# Altium schematic sheet Micro.SchDoc
size A4; SheetNumber: 5; SheetTotal: 6
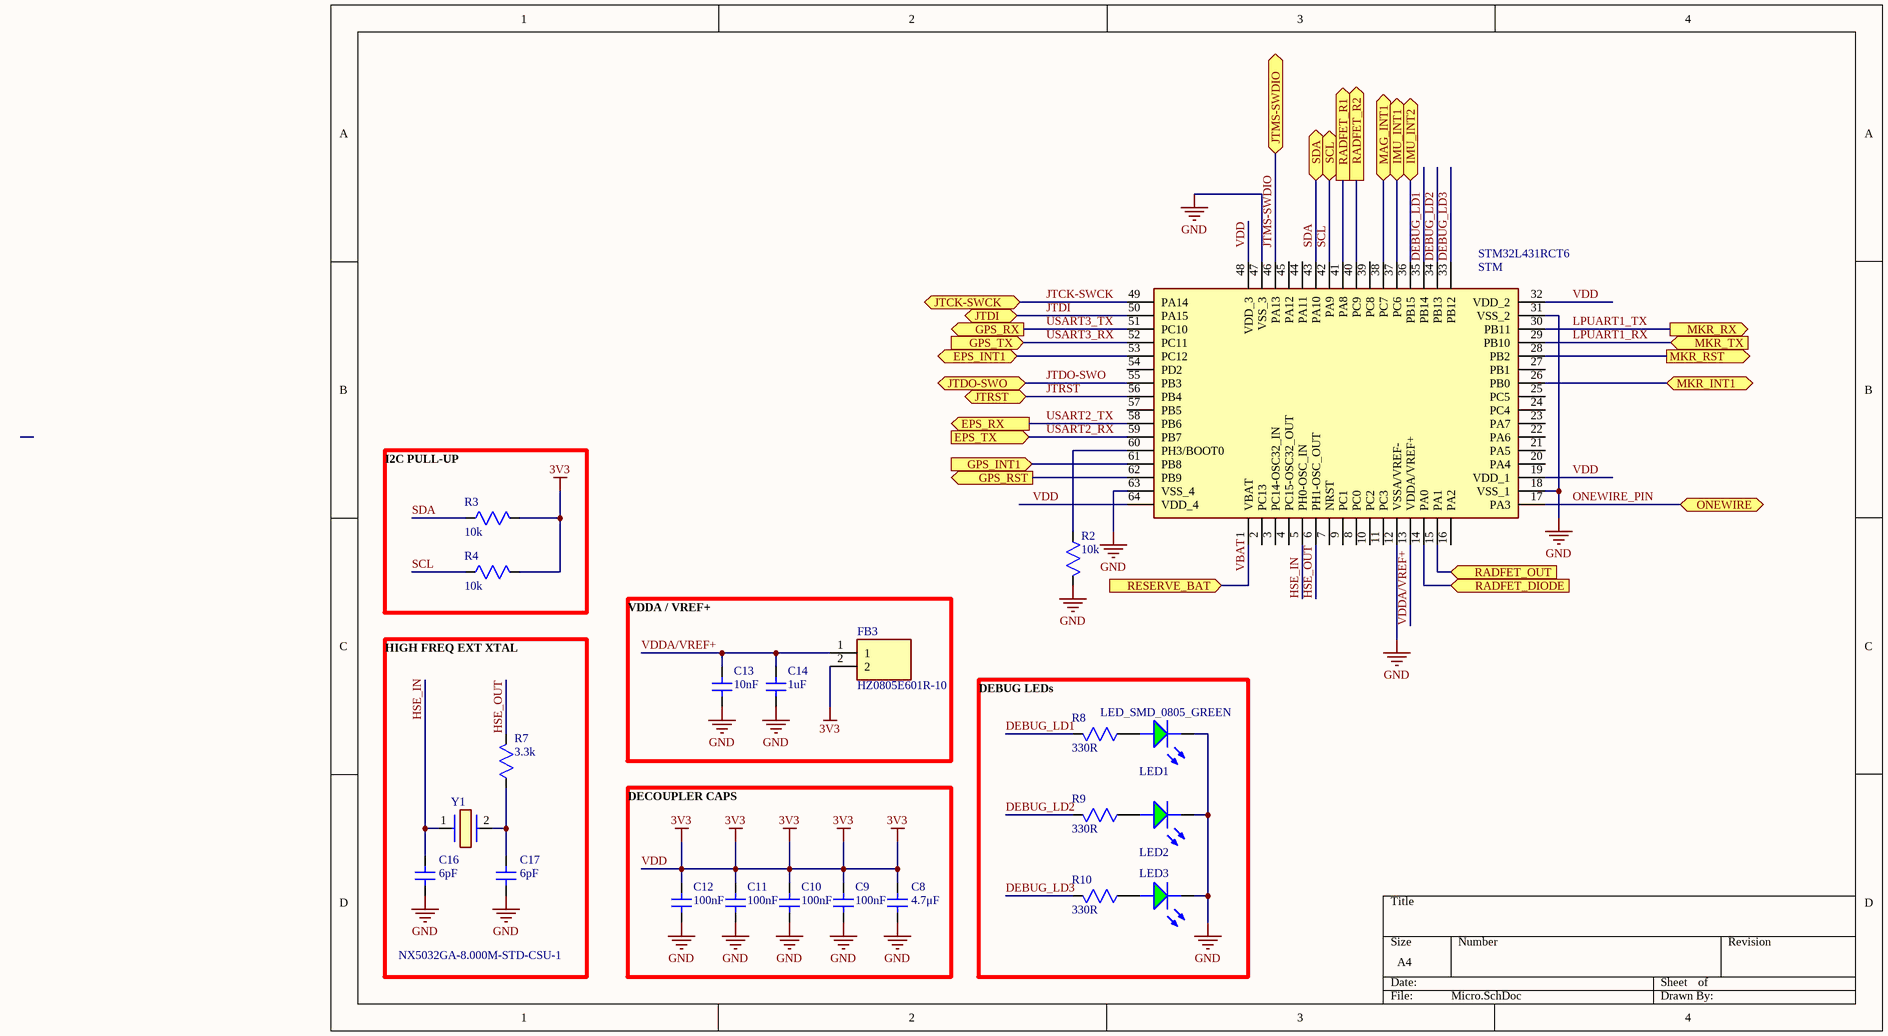
[diagram p0: Micro.SchDoc]

## Parts
C8  Valor: 4.7μF  [CAP SMD 0805]  (hidden comment: CAP_0805_4.7uF)
C9  Valor: 100nF  [CAP SMD 0805]  (hidden comment: CAP_0805_100nF)
C10  Valor: 100nF  [CAP SMD 0805]  (hidden comment: CAP_0805_100nF)
C11  Valor: 100nF  [CAP SMD 0805]  (hidden comment: CAP_0805_100nF)
C12  Valor: 100nF  [CAP SMD 0805]  (hidden comment: CAP_0805_100nF)
C13  Valor: 10nF  [CAP SMD 0805]  (hidden comment: CAP_0805_100nF)
C14  Valor: 1uF  [CAP SMD 0805]  (hidden comment: CAP_0805_100nF)
C16  Valor: 6pF  [CAP SMD 0805]  (hidden comment: CAP_0805_4.7uF)
C17  Valor: 6pF  [CAP SMD 0805]  (hidden comment: CAP_0805_4.7uF)
FB3  HZ0805E601R-10  [BEADC2012X110N]
LED1  LED_SMD_0805_GREEN  [LED SMD 0805 GREEN]  (value not drawn)
LED2  LED_SMD_0805_GREEN  [LED SMD 0805 GREEN]  (value not drawn)
LED3  LED_SMD_0805_GREEN  [LED SMD 0805 GREEN]
R2  Valor: 10k  [RES SMD 0805]  (hidden comment: RES_0805_10k)
R3  Valor: 10k  [RES SMD 0805]  (hidden comment: RES_0805_10k)
R4  Valor: 10k  [RES SMD 0805]  (hidden comment: RES_0805_10k)
R7  Valor: 3.3k  [RES SMD 0805]  (hidden comment: RES_0805_10k)
R8  Valor: 330R  [RES SMD 0805]  (hidden comment: RES_0805_10k)
R9  Valor: 330R  [RES SMD 0805]  (hidden comment: RES_0805_10k)
R10  Valor: 330R  [RES SMD 0805]  (hidden comment: RES_0805_10k)
STM  STM32L431RCT6  [QFP50P1200X1200X160-64N]
Y1  NX5032GA-8.000M-STD-CSU-1  [NX5032GA8000MSTDCSU1]

## Ports
EPS_INT1 (bidir, see General[2A], Conectores[3A]), EPS_RX (out, see General[2B], Conectores[2B]), EPS_TX (in, see General[2A], Conectores[2B]), GPS_INT1 (in, see General[2D], GPS_NEOM8M[3B]), GPS_RST (out, see General[2D], GPS_NEOM8M[3B]), GPS_RX (out, see General[2D], GPS_NEOM8M[1B]), GPS_TX (in, see General[2D], GPS_NEOM8M[1B]), IMU_INT1 (bidir, see General[2C], IMU[2B]), IMU_INT2 (bidir, see General[2C], IMU[3B]), JTCK-SWCK (bidir, see General[2B], Conectores[1B]), JTDI (bidir, see General[2B], Conectores[1B]), JTDO-SWO (bidir, see General[2B], Conectores[1B]), JTMS-SWDIO (bidir, see General[2B], Conectores[1B]), JTRST (bidir, see General[2B], Conectores[1C]), MAG_INT1 (bidir, see General[2C], Magneto[3B]), MKR_INT1 (bidir, see General[2B], Conectores[3D]), MKR_RST (out, see General[2B], Conectores[2D]), MKR_RX (out, see General[2B], Conectores[2D]), MKR_TX (in, see General[2B], Conectores[2D]), ONEWIRE (bidir, see General[2A], Conectores[1C]), RADFET_DIODE (in, see General[3B], Conectores[3A]), RADFET_OUT (in, see General[3B], Conectores[2A]), RADFET_R1 (out, see General[3A], Conectores[2A]), RADFET_R2 (out, see General[3A], Conectores[2A]), RESERVE_BAT (in, see General[2D], Conectores[2B], GPS_NEOM8M[1B]), SCL (bidir, see General[2C], Conectores[2A], Conectores[4B], IMU[2B], Magneto[2B]), SDA (bidir, see General[2C], Conectores[2A], Conectores[4B], IMU[2B], Magneto[2B])

## Nets
GND: C8.2 C9.2 C10.2 C11.2 C12.2 C13.2 C14.2 C16.2 C17.2 LED1.2(K) LED2.2(K) LED3.2(K) R2.2 STM.12(VSSA/VREF-) STM.18(VSS_1) STM.31(VSS_2) STM.47(VSS_3) STM.63(VSS_4)
VDD: C8.1 C9.1 C10.1 C11.1 C12.1 FB3.2 R3.2 R4.2 STM.19(VDD_1) STM.32(VDD_2) STM.48(VDD_3) STM.64(VDD_4)  [also labelled 3V3]
DEBUG_LD1: R8.2 STM.35(PB14)
DEBUG_LD2: R9.2 STM.34(PB13)
DEBUG_LD3: R10.2 STM.33(PB12)
EPS_INT1: STM.53(PC12) ; port EPS_INT1
GPS_INT1: STM.61(PB8) ; port GPS_INT1
GPS_RST: STM.62(PB9) ; port GPS_RST
HSE_IN: C16.1 STM.5(PH0-OSC_IN) Y1.1
HSE_OUT: R7.2 STM.6(PH1-OSC_OUT)
IMU_INT1: STM.37(PC6) ; port IMU_INT1
IMU_INT2: STM.36(PB15) ; port IMU_INT2
JTCK-SWCK: STM.49(PA14) ; port JTCK-SWCK
JTDI: STM.50(PA15) ; port JTDI
JTDO-SWO: STM.55(PB3) ; port JTDO-SWO
JTMS-SWDIO: STM.46(PA13) ; port JTMS-SWDIO
JTRST: STM.56(PB4) ; port JTRST
LPUART1_RX: STM.29(PB10) ; port MKR_TX
LPUART1_TX: STM.30(PB11) ; port MKR_RX
MAG_INT1: STM.38(PC7) ; port MAG_INT1
MKR_INT1: STM.26(PB0) ; port MKR_INT1
MKR_RST: STM.28(PB2) ; port MKR_RST
ONEWIRE_PIN: STM.17(PA3) ; port ONEWIRE
RADFET_DIODE: STM.14(PA0) ; port RADFET_DIODE
RADFET_OUT: STM.15(PA1) ; port RADFET_OUT
RADFET_R1: STM.41(PA8) ; port RADFET_R1
RADFET_R2: STM.40(PC9) ; port RADFET_R2
SCL: R4.1 STM.42(PA9) ; port SCL
SDA: R3.1 STM.43(PA10) ; port SDA
USART2_RX: STM.59(PB7) ; port EPS_TX
USART2_TX: STM.58(PB6) ; port EPS_RX
USART3_RX: STM.52(PC11) ; port GPS_TX
USART3_TX: STM.51(PC10) ; port GPS_RX
VBAT: STM.1(VBAT) ; port RESERVE_BAT
VDDA/VREF+: C13.1 C14.1 FB3.1 STM.13(VDDA/VREF+)
NetC17_1: C17.1 R7.1 Y1.2
NetLED1_1: LED1.1(A) R8.1
NetLED2_1: LED2.1(A) R9.1
NetLED3_1: LED3.1(A) R10.1
NetR2_1: R2.1 STM.60(PH3/BOOT0)

Not connected (* = marked no-connect by the designer): STM 2(PC13) 3(PC14-OSC32_IN) 4(PC15-OSC32_OUT) 7(NRST) 8(PC0) 9(PC1) 10(PC2) 11(PC3) 16(PA2) 20(PA4) 21(PA5) 22(PA6) 23(PA7) 24(PC4) 25(PC5) 27(PB1) 39(PC8) 44(PA11) 45(PA12) 54(PD2) 57(PB5)

## Notes on the sheet
- I2C PULL-UP
- VDDA / VREF+
- HIGH FREQ EXT XTAL
- DECOUPLER CAPS
- DEBUG LEDs

## Library data of the parts
C8 C16 C17 = CMP-067-0006-1: Condensador 0805 4.7uF; ComponentLink2Description: Datasheet; ComponentLink1Description: Link-Compra; ComponentLink1URL: -; Distribuidor: -; RefDistribuidor: -; Fabricante: -; Design Item ID: CAP_0805_4.7uF; Source: BMS_Slave.SCHLIB; RefFabricante: -; ComponentLink2URL: -
C9-C14 = CMP-081-000008-1: Condensador 0805 100nF; Fabricante: -; Design Item ID: CAP_0805_100nF; ComponentLink1URL: -; Distribuidor: -; Source: ARUS2021.SchLib; RefDistribuidor: -; RefFabricante: -; ComponentLink2URL: -; ComponentLink1Description: Link-Compra; ComponentLink2Description: Datasheet
FB3 = HZ0805E601R-10: Ferrite Bead; Manufacturer_Name: Laird Performance Materials; Datasheet Link: https://www.laird.com/sites/default/files/hz0805e601r-10-datasheet.pdf; Height: 1.1mm; Manufacturer_Part_Number: HZ0805E601R-10; Mouser Part Number: 875-HZ0805E601R-10; Mouser Price/Stock: https://www.mouser.co.uk/ProductDetail/Laird-Performance-Materials/HZ0805E601R-10?qs=DAHzmYU9cu2bOVmQ1ZEMSg%3D%3D
LED1-LED3 = CMP-072-0002-1: LED SMD 0805 GREEN; Fabricante: OSRAM Opto Semiconductors; RefFabricante: LG R971; ComponentLink1Description: Link-Compra; RefDistribuidor: 654-5773; Distribuidor: RS; ComponentLink1URL: https://es.rs-online.com/web/p/leds/6545773/; Source: BMS_Slave.SCHLIB; Design Item ID: LED_SMD_0805_GREEN; ComponentLink2Description: Datasheet; ComponentLink2URL: https://docs.rs-online.com/0832/0900766b808ce012.pdf
R2-R4 R7-R10 = CMP-088-000003-1: Resistencia 0805 10k; Distribuidor: -; Fabricante: -; Design Item ID: RES_0805_10k; ComponentLink1Description: Link-Compra; RefDistribuidor: -; ComponentLink2Description: Datasheet; Source: ARUS2021.SchLib; ComponentLink1URL: -; RefFabricante: -; ComponentLink2URL: -
STM = STM32L431RCT6: Integrated Circuit; Manufacturer_Name: STMicroelectronics; Datasheet Link: https://www.st.com/resource/en/datasheet/stm32l431rc.pdf; Height: 1.6mm; Manufacturer_Part_Number: STM32L431RCT6; Mouser Part Number: 511-STM32L431RCT6; Mouser Price/Stock: https://www.mouser.co.uk/ProductDetail/STMicroelectronics/STM32L431RCT6?qs=U58vgkJzipQt4Fiogdks1w%3D%3D; Arrow Part Number: STM32L431RCT6; Arrow Price/Stock: https://www.arrow.com/en/products/stm32l431rct6/stmicroelectronics?region=nac
Y1 = NX5032GA-8.000M-STD-CSU-1: Crystal or Oscillator; Manufacturer_Name: NIHON DEMPA KOGYO; Datasheet Link: https://static6.arrow.com/aropdfconversion/be518cb37ea4b57b328fa8b9d5e6b91cdc288b57/c_nx5032ga-2_e.pdf; Height: 1.5mm; Manufacturer_Part_Number: NX5032GA-8.000M-STD-CSU-1